# EAGLE design TDA2003-Amplifier-Mono (EAGLE 7.2.0)
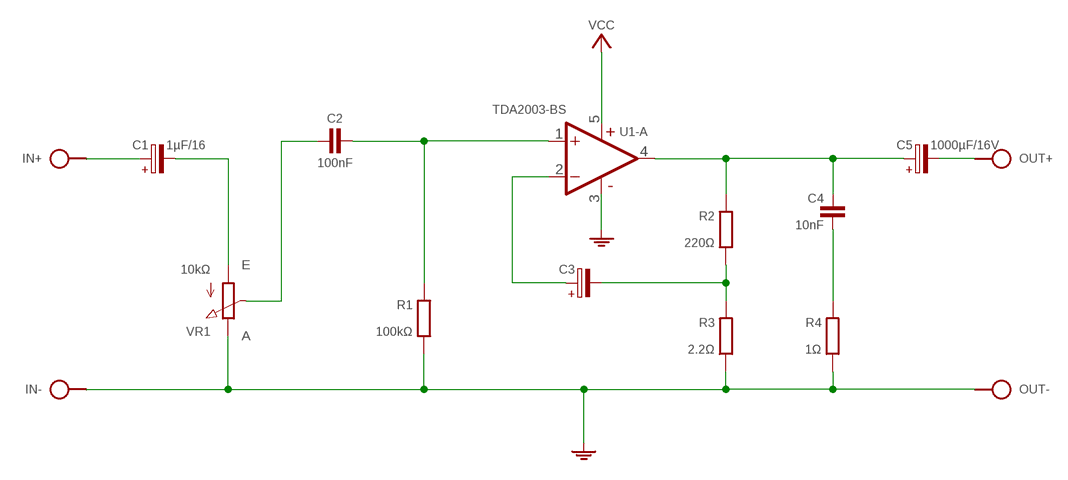
[diagram p0: schematic, sheet 1]

## Parts
C1  1µF/16  CPOL-HE2,5-3  [E2,5-3]
C2  100nF  C-H050-020X044  [C050-020X044]
C3  CPOL-HE5-4  [E5-4]
C4  10nF  C050-020X044/V  [C050-020X044/V]
C5  1000µF/16V  CPOL-HE5-5  [E5-5]
IN  SPAD+--+  [SPAD-+]
OUT  SPAD+--+  [SPAD-+]
PWR  VCC_GNDL  [SPAD-+]
R1  100kΩ  R0204/2  [0204/2]
R2  220Ω  R0204/10-V  [0204/10-V]
R3  2.2Ω  R0204/10-V  [0204/10-V]
R4  1Ω  R0204/10-V  [0204/10-V]
U1  TDA2003-BS  [TO220-B5S]
VR1  10kΩ  POT-3P  [CONN-3P]

## Nets
FB: C3.- R2.2 R3.1
GND: IN.1 OUT.1 PWR.1 R1.2 R3.2 R4.2 U1.3(-B:V-) VR1.3(E)
IN+: C2.2 R1.1 U1.1(-A:+IN)
IN-: C3.+ U1.2(-A:-IN)
N$1: C1.- VR1.1(A)
N$2: C2.1 VR1.2(S)
N$6: C4.2 R4.1
N$9: C1.+ IN.2
OAC: C5.- OUT.2
OUT: C4.1 C5.+ R2.1 U1.4(-A:OUT)
VCC: PWR.2 U1.5(-B:V+)

## Library data of the parts
C1 C3 C5 = c:CPOL-H
C2 = c:C-H
C4 = c:C: CAPACITOR, European symbol
IN OUT = pad:SPAD+-
PWR = pad:VCC_GND
R1-R4 = r:R: RESISTOR, European symbol
U1 = ic:TDA2003
VR1 = r:POT

## Board
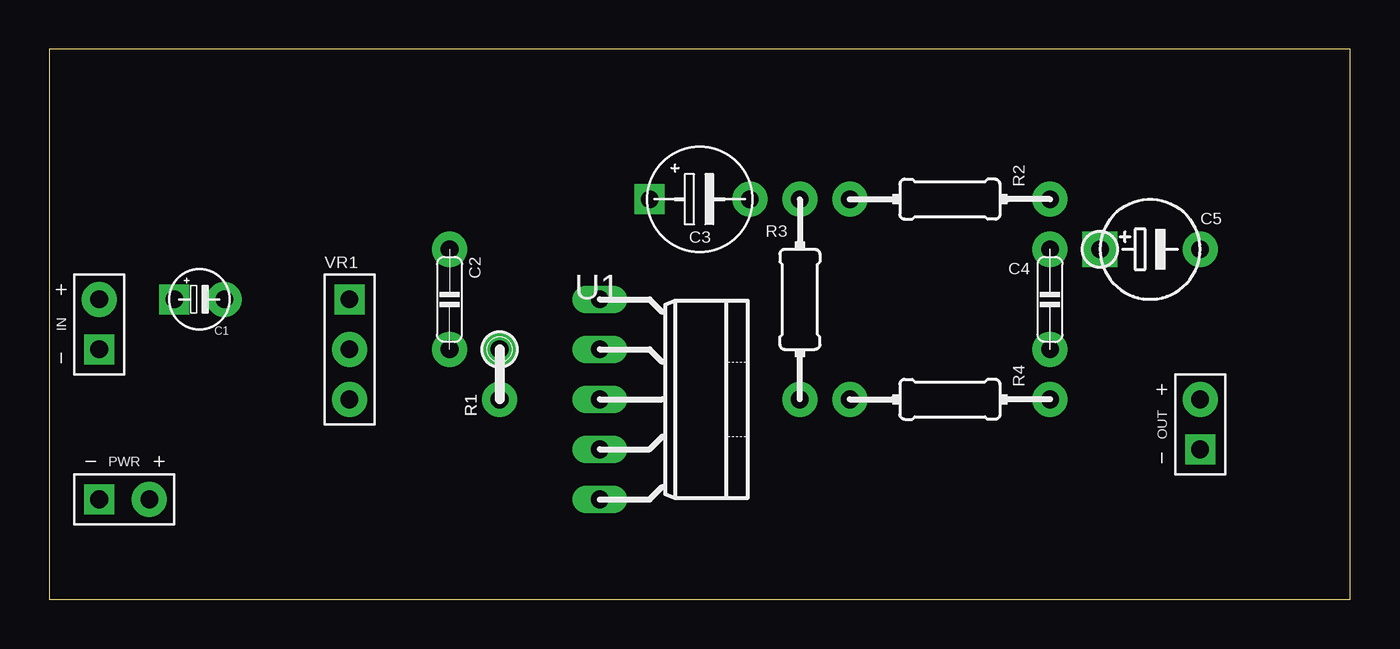
[diagram p1: board, top side]
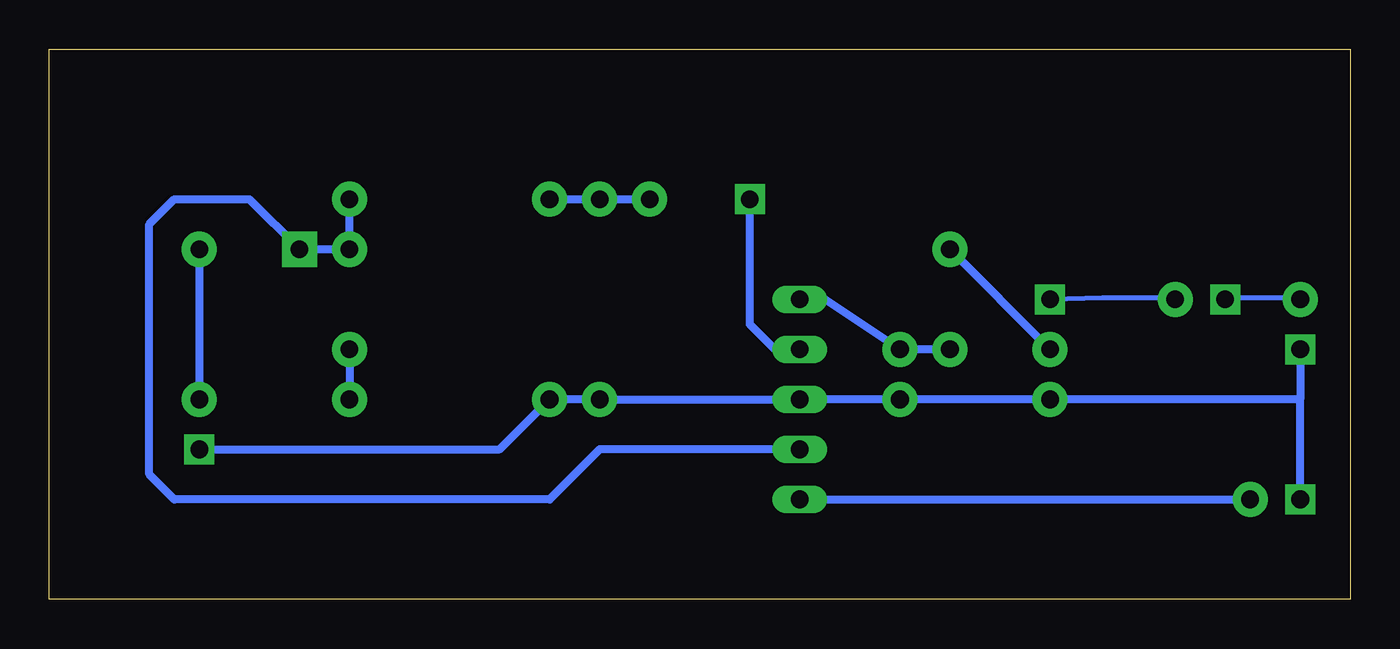
[diagram p2: board, bottom side, seen from below]

Size 66.04 x 27.94 mm. Coordinates in mm from the lower left corner, seen from the top.
Outline: 0,0 66.04,0 66.04,27.94 0,27.94 0,0
Copper layers (1*16): Top 0.035mm / dielectric 1.5mm / Bottom 0.035mm
Design rules "default": minimum track width 10mil, minimum drill 24mil, track to track 8mil, track to pad 8mil, pad to pad 8mil, via to via 8mil, smd to smd 8mil, copper to edge 40mil, drill to drill 8mil, minimum pad ring 10mil, minimum via ring 8mil, stop-mask expansion 4mil, vias tented up to drill 0mil, thermal gap 10mil

### Footprints (pad centres in the part's own frame; a part is rotated, then mirrored left to right if it is on the bottom)
E2,5-3 = drill 0.9 pad 1.524 square: + -1.27,0 | drill 0.9 pad 1.778: - 1.27,0
C050-020X044 = drill 0.9 pad 1.778: 1 -2.54,0; 2 2.54,0
E5-4 = drill 0.9 pad 1.524 square: + -2.54,0 | drill 0.9 pad 1.778: - 2.54,0
C050-020X044/V = drill 0.9 pad 1.778: 1 0,2.54; 2 0,-2.54
E5-5 = drill 0.9 pad 1.778 square: + -2.54,0 | drill 0.9 pad 1.778: - 2.54,0
SPAD-+ = drill 0.9 pad 1.524 square: 1 0,-1.27 | drill 0.9 pad 1.778: 2 0,1.27
0204/2 = drill 0.9 pad 1.778: 1 1.27,0; 2 -1.27,0
0204/10-V = drill 0.9 pad 1.778: 1 0,5.08; 2 0,-5.08
TO220-B5S = drill 0.9 long: 1 -5.08,-5.08; 2 -2.54,-5.08; 3 0,-5.08; 4 2.54,-5.08; 5 5.08,-5.08
CONN-3P = drill 0.9 pad 1.524 square: 1 0,2.54 | drill 0.9 pad 1.778: 2 0,0; 3 0,-2.54

### Placement (x,y rotation side)
C1  7.62,15.24 0 top
C2  20.32,15.24 270 top
C3  33.02,20.32 0 top
C4  50.8,15.24 0 top
C5  55.88,17.78 0 top
IN  2.54,13.97 0 top
OUT  58.42,8.89 0 top
PWR  3.81,5.08 270 top
R1  22.86,11.43 90 top
R2  45.72,20.32 270 top
R3  38.1,15.24 0 top
R4  45.72,10.16 270 top
U1  33.02,10.16 270 top
VR1  15.24,12.7 0 top

### Tracks (layer width: path | path; a pad name or v marks a point on that pad's centre or on a via)
FB
  Bottom 0.406: R3.1 R2.2 C3.-
GND
  Bottom 0.406: OUT.1 43.18,7.62 R4.2 R3.2 U1.3 R1.2 VR1.3 2.54,10.16 | PWR.1 2.54,10.16 | IN.1 2.54,10.16
IN+
  Bottom 0.406: C2.2 R1.1 26.67,15.24 U1.1
IN-
  Bottom 0.406: U1.2 29.21,12.7 30.48,13.97 C3.+
N$1
  Bottom 0.254: VR1.1 12.57,15.32 8.91,15.32 C1.-
N$2
  Bottom 0.406: VR1.2 C2.1
N$6
  Bottom 0.406: C4.2 R4.1
N$9
  Bottom 0.254: C1.+ 6.17,15.32 2.74,15.32 IN.2
OAC
  Bottom 0.406: C5.- OUT.2
OUT
  Bottom 0.406: R2.1 C4.1 C5.+ 55.88,20.32 59.69,20.32 60.96,19.05 60.96,6.35 59.69,5.08 40.64,5.08 38.1,7.62 U1.4
VCC
  Bottom 0.406: U1.5 PWR.2